# Altium schematic sheet Shield.SchDoc
size B; SheetNumber: 1; SheetTotal: 3
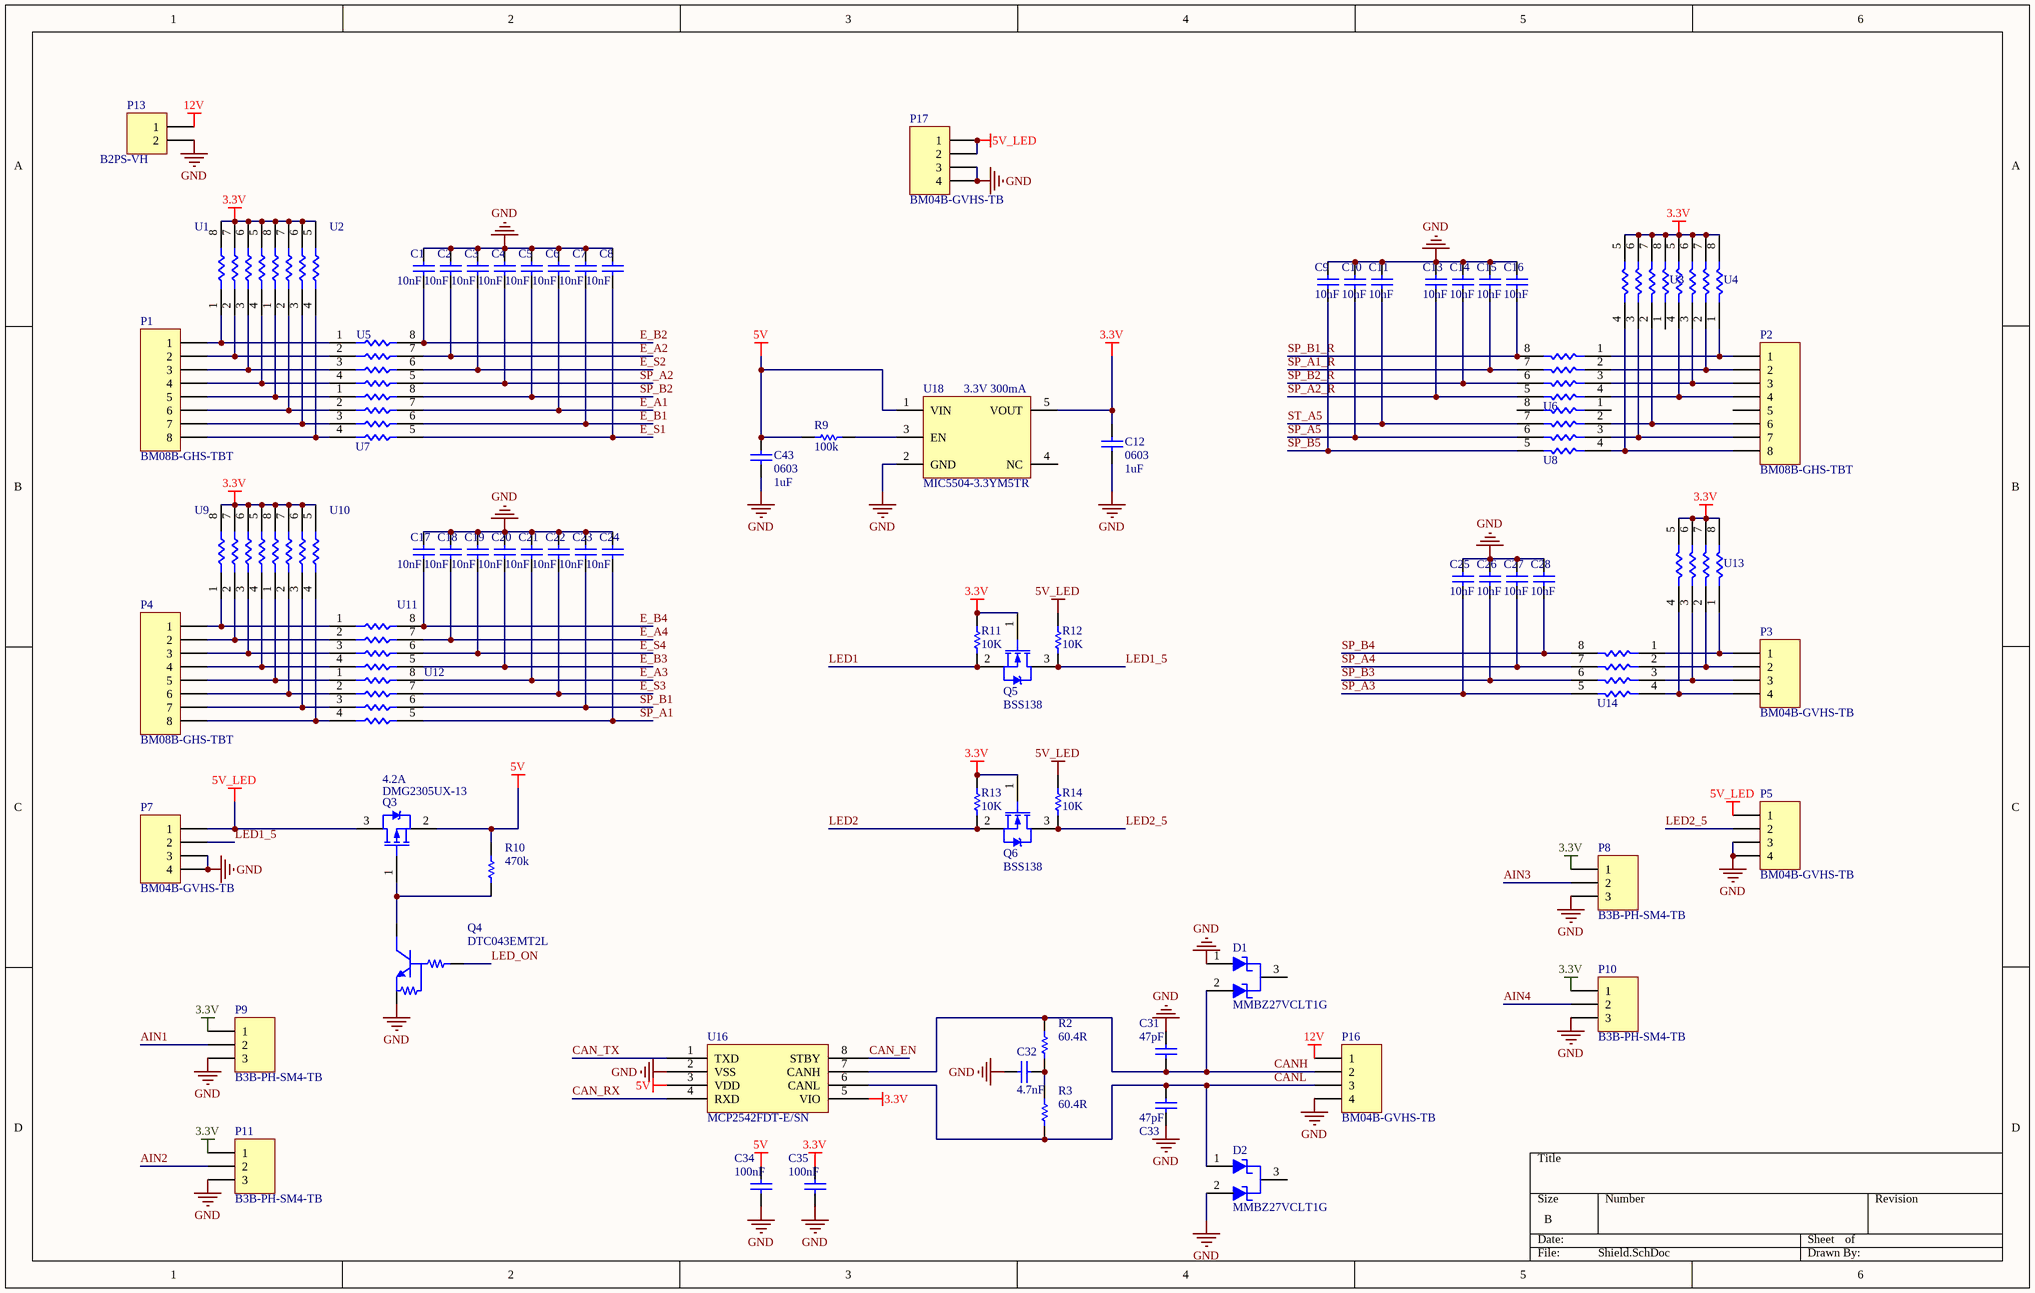
[diagram p0: Shield.SchDoc]

## Parts
C1  10nF  [C0402]
C2  10nF  [C0402]
C3  10nF  [C0402]
C4  10nF  [C0402]
C5  10nF  [C0402]
C6  10nF  [C0402]
C7  10nF  [C0402]
C8  10nF  [C0402]
C9  10nF  [C0402]
C10  10nF  [C0402]
C11  10nF  [C0402]
C12  0603  value 1uF  [C0603]
C13  10nF  [C0402]
C14  10nF  [C0402]
C15  10nF  [C0402]
C16  10nF  [C0402]
C17  10nF  [C0402]
C18  10nF  [C0402]
C19  10nF  [C0402]
C20  10nF  [C0402]
C21  10nF  [C0402]
C22  10nF  [C0402]
C23  10nF  [C0402]
C24  10nF  [C0402]
C25  10nF  [C0402]
C26  10nF  [C0402]
C27  10nF  [C0402]
C28  10nF  [C0402]
C31  47pF  [C0402]
C32  4.7nF  [C0402]
C33  47pF  [C0402]
C34  100nF  [C0402]
C35  100nF  [C0402]
C43  0603  value 1uF  [C0603]
D1  MMBZ27VCLT1G  [SOT-23]
D2  MMBZ27VCLT1G  [SOT-23]
P1  BM08B-GHS-TBT  [CONN-BM08B-GHS-TBT]
P2  BM08B-GHS-TBT  [CONN-BM08B-GHS-TBT - INVERTED]
P3  BM04B-GVHS-TB  [CONN-SM04B-GHSV-TB - INVERTED]
P4  BM08B-GHS-TBT  [CONN-BM08B-GHS-TBT]
P5  BM04B-GVHS-TB  [CONN-SM04B-GHSV-TB - INVERTED]
P7  BM04B-GVHS-TB  [CONN-SM04B-GHSV-TB]
P8  B3B-PH-SM4-TB  [CONN-B3B-PH-SM4-TB]
P9  B3B-PH-SM4-TB  [CONN-B3B-PH-SM4-TB]
P10  B3B-PH-SM4-TB  [CONN-B3B-PH-SM4-TB]
P11  B3B-PH-SM4-TB  [CONN-B3B-PH-SM4-TB]
P13  B2PS-VH  [CONN-B2PS-VH]
P16  BM04B-GVHS-TB  [CONN-SM04B-GHSV-TB - INVERTED]
P17  BM04B-GVHS-TB  [CONN-SM04B-GHSV-TB - INVERTED]
Q3  DMG2305UX-13  Continuous Drain Current (ID): 4.2A  [SOT23-3]
Q4  DTC043EMT2L  [SOT-723]
Q5  BSS138  [SOT-23]
Q6  BSS138  [SOT-23]
R2  60.4R  [R0402]
R3  60.4R  [R0402]
R9  value 100k  [R0402]
R10  value 470k  [R0402]
R11  value 10K  [R0402]  (hidden comment: Res1)
R12  value 10K  [R0402]  (hidden comment: Res1)
R13  value 10K  [R0402]  (hidden comment: Res1)
R14  value 10K  [R0402]  (hidden comment: Res1)
U1  CAY16-1002F4LF  [RES_ARRAY_4]  (value not drawn)
U2  CAY16-1002F4LF  [RES_ARRAY_4]  (value not drawn)
U3  CAY16-1002F4LF  [RES_ARRAY_4 - INVERTED]  (value not drawn)
U4  CAY16-1002F4LF  [RES_ARRAY_4 - INVERTED]  (value not drawn)
U5  CAY16-1002F4LF  [RES_ARRAY_4 - INVERTED]  (value not drawn)
U6  CAY16-1002F4LF  [RES_ARRAY_4]  (value not drawn)
U7  CAY16-1002F4LF  [RES_ARRAY_4 - INVERTED]  (value not drawn)
U8  CAY16-1002F4LF  [RES_ARRAY_4]  (value not drawn)
U9  CAY16-1002F4LF  [RES_ARRAY_4]  (value not drawn)
U10  CAY16-1002F4LF  [RES_ARRAY_4]  (value not drawn)
U11  CAY16-1002F4LF  [RES_ARRAY_4 - INVERTED]  (value not drawn)
U12  CAY16-1002F4LF  [RES_ARRAY_4 - INVERTED]  (value not drawn)
U13  CAY16-1002F4LF  [RES_ARRAY_4]  (value not drawn)
U14  CAY16-1002F4LF  [RES_ARRAY_4]  (value not drawn)
U16  MCP2542FDT-E/SN  [SOIC-8(150MIL)]
U18  MIC5504-3.3YM5TR  value 3.3V 300mA  [SOT23-5]

## Nets
3.3V: C12.2 C35.2 P8.1 P9.1 P10.1 P11.1 Q5.1(G) Q6.1(G) R11.1 R13.1 U1.5 U1.6 U1.7 U1.8 U2.5 U2.6 U2.7 U2.8 U3.5 U3.6 U3.7 U3.8 U4.5 U4.6 U4.7 U4.8 U9.5 U9.6 U9.7 U9.8 U10.5 U10.6 U10.7 U10.8 U13.5 U13.6 U13.7 U13.8 U16.5(VIO) U18.5(VOUT)
5V: C34.2 C43.2 Q3.2(S) R9.1 R10.2 U16.3(VDD) U18.1(VIN)
5V_LED: P5.1 P7.1 P17.1 P17.2 Q3.3(D) R12.1 R14.1
12V: P13.1 P16.1
GND: C1.2 C2.2 C3.2 C4.2 C5.2 C6.2 C7.2 C8.2 C9.2 C10.2 C11.2 C12.1 C13.2 C14.2 C15.2 C16.2 C17.2 C18.2 C19.2 C20.2 C21.2 C22.2 C23.2 C24.2 C25.2 C26.2 C27.2 C28.2 C31.2 C32.2 C33.1 C34.1 C35.1 C43.1 D1.1 D2.2(C) P5.3 P5.4 P7.3 P7.4 P8.3 P9.3 P10.3 P11.3 P13.2 P16.4 P17.3 P17.4 Q4.2(E) U16.2(VSS) U18.2(GND)
AIN1: P9.2
AIN2: P11.2
AIN3: P8.2
AIN4: P10.2
CAN_EN: U16.8(STBY)
CAN_RX: U16.4(RXD)
CAN_TX: U16.1(TXD)
CANH: C31.1 D1.2(C) P16.2 R2.2 U16.7(CANH)
CANL: C33.2 D2.1 P16.3 R3.1 U16.6(CANL)
E_A1: C6.1 U7.7
E_A2: C2.1 U5.7
E_A3: C21.1 U12.8
E_A4: C18.1 U11.7
E_B1: C7.1 U7.6
E_B2: C1.1 U5.8
E_B3: C20.1 U11.5
E_B4: C17.1 U11.8
E_S1: C8.1 U7.5
E_S2: C3.1 U5.6
E_S3: C22.1 U12.7
E_S4: C19.1 U11.6
LED1: Q5.2(S) R11.2
LED1_5: P7.2 Q5.3(D) R12.2
LED2: Q6.2(S) R13.2
LED2_5: P5.2 Q6.3(D) R14.2
LED_ON: Q4.1(B)
SP_A1: C24.1 U12.5
SP_A1_R: C15.1 U6.7
SP_A2: C4.1 U5.5
SP_A2_R: C13.1 U6.5
SP_A3: C25.1 U14.5
SP_A4: C27.1 U14.7
SP_A5: C10.1 U8.6
SP_B1: C23.1 U12.6
SP_B1_R: C16.1 U6.8
SP_B2: C5.1 U7.8
SP_B2_R: C14.1 U6.6
SP_B3: C26.1 U14.6
SP_B4: C28.1 U14.8
SP_B5: C9.1 U8.5
ST_A5: C11.1 U8.7
NetC32_1: C32.1 R2.1 R3.2
NetP1_1: P1.1 U1.1 U5.1
NetP1_2: P1.2 U1.2 U5.2
NetP1_3: P1.3 U1.3 U5.3
NetP1_4: P1.4 U1.4 U5.4
NetP1_5: P1.5 U2.1 U7.1
NetP1_6: P1.6 U2.2 U7.2
NetP1_7: P1.7 U2.3 U7.3
NetP1_8: P1.8 U2.4 U7.4
NetP2_1: P2.1 U4.1 U6.1
NetP2_2: P2.2 U4.2 U6.2
NetP2_3: P2.3 U4.3 U6.3
NetP2_4: P2.4 U4.4 U6.4
NetP2_6: P2.6 U3.2 U8.2
NetP2_7: P2.7 U3.3 U8.3
NetP2_8: P2.8 U3.4 U8.4
NetP3_1: P3.1 U13.1 U14.1
NetP3_2: P3.2 U13.2 U14.2
NetP3_3: P3.3 U13.3 U14.3
NetP3_4: P3.4 U13.4 U14.4
NetP4_1: P4.1 U9.1 U11.1
NetP4_2: P4.2 U9.2 U11.2
NetP4_3: P4.3 U9.3 U11.3
NetP4_4: P4.4 U9.4 U11.4
NetP4_5: P4.5 U10.1 U12.1
NetP4_6: P4.6 U10.2 U12.2
NetP4_7: P4.7 U10.3 U12.3
NetP4_8: P4.8 U10.4 U12.4
NetQ3_1: Q3.1(G) Q4.3(C) R10.1
NetR9_2: R9.2 U18.3(EN)

Not connected (* = marked no-connect by the designer): D1 3(K); D2 3(K); P2 5; U3 1; U8 1 8; U18 4(NC)

## Library data of the parts
C1-C11 C13-C28 = Cap: Multilayer Ceramic Capacitor, 0.01 uF, 16 V, ± 5%, C0G (NP0), 0402 [1005 Metric]; Manufacturer: Yageo; Manufacturer Part Number: CC0402KRX7R7BB103; Voltage Rating: 16V; Tolerance: 10%; Dielectric: X7R; Insulation Resistance: 10GR; Dissipation Factor: 3.5%; Supplier 1: Digi-Key; Supplier Part Number 1: 311-1042-1-ND; RoHS: Yes; Category: Ceramic Capacitors; Stock 1: 2573957; Pricing 1: 1=0.1, 10=0.016, 50=0.0088, 100=0.0071, 500=0.0051, 1000=0.004, 2500=0.00364, 5000=0.00335 (USD); Mount: Surface Mount; Case/Package: 0402; Number of Pins: 2; Case Code (Metric): 1005; Case Code (Imperial): 0402; Min Operating Temperature: -55°C; Max Operating Temperature: 125°C; Capacitance: 10nF; Packaging: Tape and Reel; Series: CC; Voltage Rating (DC): 16V; Termination: SMD/SMT; Package Quantity: 1; Length: 1mm; Width: 0.02inch; Height: 0.5mm; Depth: 0.5mm; Thickness: 0.022inch; Radiation Hardening: No; RoHS Compliant: Yes; Reach SVHC Compliant: No; Lead Free: Lead Free; Halogen Free: Halogen Free; ComponentLink1URL: https://datasheet.ciiva.com/143/mlccorderingcode-143951.pdf?src-supplier=Digi-Key; ComponentLink1Description: https://datasheet.ciiva.com/143/mlccorderingcode-143951.pdf?src-supplier=Digi-Key; ComponentLink2URL: https://datasheet.ciiva.com/143/mlccorderingcode-143950.pdf?src-supplier=Digi-Key; ComponentLink2Description: https://datasheet.ciiva.com/143/mlccorderingcode-143950.pdf?src-supplier=Digi-Key; ComponentLink3URL: https://datasheet.ciiva.com/143/upy-gphc-x7r-6-3v-to-50v-8-143952.pdf?src-supplier=Digi-Key; ComponentLink3Description: https://datasheet.ciiva.com/143/upy-gphc-x7r-6-3v-to-50v-8-143952.pdf?src-supplier=Digi-Key; ComponentLink4URL: https://datasheet.ciiva.com/8033/70765-8033655.pdf?src-supplier=Element14; ComponentLink4Description: https://datasheet.ciiva.com/8033/70765-8033655.pdf?src-supplier=Element14; ComponentLink5URL: https://datasheet.ciiva.com/7978/1489800-7978109.pdf?src-supplier=Element14; ComponentLink5Description: https://datasheet.ciiva.com/7978/1489800-7978109.pdf?src-supplier=Element14; ComponentLink6URL: https://datasheet.ciiva.com/28450/1489800-28450330.pdf?src-supplier=Element14; ComponentLink6Description: https://datasheet.ciiva.com/28450/1489800-28450330.pdf?src-supplier=Element14; ComponentLink7URL: https://datasheet.ciiva.com/8033/1489800-8033659.pdf?src-supplier=Element14; ComponentLink7Description: https://datasheet.ciiva.com/8033/1489800-8033659.pdf?src-supplier=Element14; ComponentLink8URL: https://datasheet.ciiva.com/8033/1489800-8033658.pdf?src-supplier=Element14; ComponentLink8Description: https://datasheet.ciiva.com/8033/1489800-8033658.pdf?src-supplier=Element14; ComponentLink9URL: https://datasheet.ciiva.com/5425/upy-gp-np0-16v-to-50v-8-3714-5425438.pdf?src-supplier=Mouser; ComponentLink9Description: https://datasheet.ciiva.com/5425/upy-gp-np0-16v-to-50v-8-3714-5425438.pdf?src-supplier=Mouser
C12 C43 = Cap: Capacitor; Published: 8-Jun-2000; LatestRevisionDate: 17-Jul-2002; LatestRevisionNote: Re-released for DXP Platform.; PackageReference: RAD-0.3; Publisher: Altium Limited; PackageDescription: Radial Cap, Thru-Hole; 2 Leads; 0.3 in Pin Spacing
C31 C33 = Cap: Cap Cer 47PF 100V C0G/NP0 0402; Manufacturer: Wurth Electronics; Manufacturer Part Number: 885012005078; Tolerance: 5%; Supplier 1: Digi-Key; Supplier Part Number 1: 732-12071-1-ND; RoHS: Yes; Category: Ceramic Capacitors; Stock 1: 57686; Pricing 1: 1=0.1, 10=0.039, 100=0.035, 500=0.031 (USD); Mount: Surface Mount; Case/Package: 0402; Case Code (Imperial): 0402; Case Code (Metric): 1005; Min Operating Temperature: -55°C; Max Operating Temperature: 125°C; Packaging: Cut Tape; Capacitance: 47pF; Series: WCAP-CSGP; Voltage Rating: 100V; ComponentLink1URL: http://www.farnell.com/datasheets/2546566.pdf?src-supplier=Farnell; ComponentLink1Description: http://www.farnell.com/datasheets/2546566.pdf?src-supplier=Farnell; ComponentLink2URL: https://katalog.we-online.de/pbs/datasheet/885012005078.pdf?src-supplier=Digi-Key; ComponentLink2Description: https://katalog.we-online.de/pbs/datasheet/885012005078.pdf?src-supplier=Digi-Key; ComponentLink3URL: http://www.farnell.com/datasheets/2546566.pdf?src-supplier=Newark; ComponentLink3Description: http://www.farnell.com/datasheets/2546566.pdf?src-supplier=Newark
C32 = Cap: Cap Cer 4700PF 100V X7R 0402; Manufacturer: Wurth Electronics; Manufacturer Part Number: 885012205084; Tolerance: 10%; Supplier 1: Digi-Key; Supplier Part Number 1: 732-12234-1-ND; RoHS: No; Category: Ceramic Capacitors; Stock 1: 14393; Pricing 1: 1=0.1, 10=0.039, 100=0.035, 500=0.031 (USD); Mount: Surface Mount; Case/Package: 0402; Case Code (Imperial): 0402; Case Code (Metric): 1005; Min Operating Temperature: -55°C; Max Operating Temperature: 125°C; Packaging: Cut Tape; Capacitance: 4.7nF; Series: WCAP-CSGP; Voltage Rating: 100V; ComponentLink1URL: http://www.farnell.com/datasheets/2546792.pdf?src-supplier=Farnell; ComponentLink1Description: http://www.farnell.com/datasheets/2546792.pdf?src-supplier=Farnell; ComponentLink2URL: https://katalog.we-online.de/pbs/datasheet/885012205084.pdf?src-supplier=Digi-Key; ComponentLink2Description: https://katalog.we-online.de/pbs/datasheet/885012205084.pdf?src-supplier=Digi-Key; ComponentLink3URL: http://www.farnell.com/datasheets/2546792.pdf?src-supplier=Newark; ComponentLink3Description: http://www.farnell.com/datasheets/2546792.pdf?src-supplier=Newark; ComponentLink4URL: http://www.farnell.com/datasheets/2546792.pdf?src-supplier=Element14; ComponentLink4Description: http://www.farnell.com/datasheets/2546792.pdf?src-supplier=Element14
C34 C35 = Cap: 100nF ±10% 16V X7R 0402 Multilayer Ceramic Capacitors MLCC - SMD/SMT RoHS; Manufacturer: KEMET; Manufacturer Part Number: C0402C104K4RAC-TU; Dissipation Factor: 3.5%; Supplier 1: Digi-Key; Supplier Part Number 1: 399-C0402C104K4RAC7867CT-ND; RoHS: Yes; Category: Ceramic Capacitors; Stock 1: 4665619; Pricing 1: 1=0.1, 10=0.032, 50=0.0172, 100=0.0141, 500=0.01008, 1000=0.00792, 2500=0.0072, 5000=0.00662 (USD); Case/Package: 0402; Number of Pins: 2; Case Code (Metric): 1005; Case Code (Imperial): 0402; Dielectric Material: Ceramic; Min Operating Temperature: -55°C; Max Operating Temperature: 125°C; Capacitance: 100nF; Tolerance: 10%; Voltage Rating: 16V; Packaging: Tape and Reel; Series: C; Dielectric: X7R; Voltage: 16V; Termination: SMD/SMT; Length: 1mm; Height: 0.5mm; Depth: 0.5mm; Reach SVHC Compliant: No
D1 D2 = MMBZ27VCLT1G: TVS DIODE 22VWM 38VC SOT23; Manufacturer: ON Semiconductor; Direction: Unidirectional,Bidirectional; Number of Elements: 2; Reverse Breakdown Voltage: 25.65V; Operating Supply Voltage: 22V; Max Surge Current: 1A; Polarity: Unidirectional; Clamping Voltage: 38V; Peak Pulse Power: 40W; Power Line Protection: No; Leakage Current: 50nA; Test Current: 1mA; ESD Protection: Yes; Diode Type: ZENER; Max Breakdown Voltage: 28.35V; Voltage Rating (DC): 27V; Supplier 1: Digi-Key; Supplier Part Number 1: MMBZ27VCLT1GOSCT-ND; Manufacturer Part Number: MMBZ27VCLT1G; RoHS: Yes; Category: Zener Diodes; Stock 1: 25970; Pricing 1: 1=0.2, 10=0.14, 100=0.0684, 500=0.05708, 1000=0.03966 (USD); Case/Package: SOT-23-3; Number of Pins: 3; Min Operating Temperature: -55°C; Max Operating Temperature: 150°C; Package Quantity: 3000; Packaging: Tape and Reel; Number of Channels: 2; Breakdown Voltage: 25.65V; Termination: SMD/SMT; Number of Unidirectional Channels: 2; Reverse Standoff Voltage: 22V; Min Breakdown Voltage: 25.65V; Working Voltage: 22V; Peak Pulse Current: 1A; Max Reverse Leakage Current: 50nA; Series: -; Power Dissipation: 40W; Clamping Voltage-Max: 38V; Length: 2.9mm; Width: 1.3mm; Height: 0.94mm; Depth: 1.3mm; Radiation Hardening: No; Reach SVHC Compliant: No; Lead Free: Lead Free; RoHS Compliant: Yes; ComponentLink1URL: https://datasheet.ciiva.com/34303/2011918-34303829.pdf?src-supplier=Jameco; ComponentLink1Description: https://datasheet.ciiva.com/34303/2011918-34303829.pdf?src-supplier=Jameco; ComponentLink2URL: https://datasheet.ciiva.com/18426/70099539-18426859.pdf?src-supplier=Allied+Electronics; ComponentLink2Description: https://datasheet.ciiva.com/18426/70099539-18426859.pdf?src-supplier=Allied+Electronics
P1 P2 P4 = Header 8: Header, 8-Pin; Manufacturer: JST; Supplier 1: Digi-Key; Supplier Part Number 1: 455-BM08B-GHS-TBTCT-ND; Manufacturer Part Number: BM08B-GHS-TBT; RoHS: No; Stock 1: 108322; Pricing 1: 1=0.59, 10=0.512, 100=0.422, 500=0.367, 1000=0.30277 (USD)
P3 P5 P7 P16 P17 = Header 4: Conn Header SMD 4POS 1.25MM; Manufacturer: JST; Supplier 1: DigiKey; Supplier Part Number 1: 455-BM04B-GVHS-TBCT-ND; Manufacturer Part Number: BM04B-GVHS-TB; Stock 1: 920; Pricing 1: 1=0.5, 10=0.422, 100=0.3284, 500=0.2815, 1000=0.23458 (USD)
P8-P11 = Header 3: Header B3B-PH-SM4-TB, 2.00mm, 3-contacts, top entry, SMT /1000/reel; Manufacturer: JST; Supplier 1: Digi-Key; Supplier Part Number 1: 455-B3B-PH-SM4-TBCT-ND; Manufacturer Part Number: B3B-PH-SM4-TB; RoHS: No; Stock 1: 75711; Pricing 1: 1=0.62, 10=0.541, 100=0.4459, 500=0.38772 (USD); Orientation: Vertical
P13 = Header 2: Header B2PS-VH, 3.96mm, 2-contacts, side entry, THT/1000/box; Manufacturer: JST; Number of Positions: 2; Gender: Male; Pitch: 0.156inch; Supplier 1: Digi-Key; Supplier Part Number 1: 455-B2PS-VH-ND; Manufacturer Part Number: B2PS-VH; RoHS: Yes; Category: Connectors; Stock 1: 60240; Pricing 1: 1=0.25, 10=0.209, 100=0.1612, 500=0.13636, 1000=0.11157, 5000=0.09917, 10000=0.08987 (USD); Mount: Through Hole; Color: Natural; Contact Plating: Tin,Lead; Housing Color: Natural; Contact Material: Brass; Housing Material: Nylon; Fastening Type: Ramp; Packaging: Bulk; Package Quantity: 1000; Number of Rows: 1; Termination: Solder; Orientation: Horizontal; Number of Contacts: 2; Series: VH; Contact Type: Male Pin; Contact Mating Length: 0.303inch; Lead Free: Contains Lead; ComponentLink1URL: https://datasheet.ciiva.com/6905/vhseries-6905894.pdf?src-supplier=Digi-Key; ComponentLink1Description: https://datasheet.ciiva.com/6905/vhseries-6905894.pdf?src-supplier=Digi-Key
Q3 = ZXMP10A13FTA: MOSFET P-CH 20V 4.2A SOT23; Manufacturer: Diodes; Rise Time: 13.7ns; Rds On Max: 52mR; Input Capacitance: 808pF; Max Power Dissipation: 1.4W; Turn-On Delay Time: 10.8ns; Turn-Off Delay Time: 79.3ns; Fall Time: 34.7ns; Threshold Voltage: -900mV; Element Configuration: Single; Gate to Source Voltage (Vgs): 8V; Number of Channels: 1; Drain to Source Breakdown Voltage: -20V; On-State Resistance: 65MR; Supplier 1: Digi-Key; Supplier Part Number 1: DMG2305UX-13DICT-ND; Manufacturer Part Number: DMG2305UX-13; Stock 1: 562398; Pricing 1: 1=0.38, 10=0.348, 100=0.1948, 500=0.1044, 1000=0.071 (EUR); Mount: Surface Mount; Case/Package: SOT-23; Number of Pins: 3; Weight: 0.000282oz; Min Operating Temperature: -55°C; Max Operating Temperature: 150°C; Package Quantity: 1; Packaging: Tape and Reel; Drain to Source Voltage (Vdss): 20V; Drain to Source Resistance: 52mR; Length: 3mm; Height: 1.1mm; Width: 1.4mm; Radiation Hardening: No; REACH SVHC: No SVHC; Lead Free: Lead Free; ComponentLink1URL: http://www.diodes.com/datasheets/DMG2305UX.pdf; ComponentLink1Description: http://www.diodes.com/datasheets/DMG2305UX.pdf; ComponentLink2URL: https://www.diodes.com/assets/Datasheets/DMG2305UX.pdf; ComponentLink2Description: https://www.diodes.com/assets/Datasheets/DMG2305UX.pdf
Q4 = DTC043EMT2L: TRANS PREBIAS NPN 50V VMT3; Manufacturer: Rohm; Max Collector Current: 100mA; Collector Emitter Voltage (VCEO): 150mV; Transition Frequency: 250MHz; Max Power Dissipation: 150mW; Element Configuration: Single; Output Voltage: 50mV; Supplier 1: Digi-Key; Manufacturer Part Number: DTC043EMT2L; Stock 1: 216; Pricing 1: 1=0.2, 10=0.166, 25=0.1392, 100=0.0881, 250=0.068, 500=0.0579, 1000=0.0394, 2500=0.0355 (USD); Mount: Surface Mount; Case/Package: SOT-723; Number of Pins: 3; Max Operating Temperature: 150°C; Packaging: Tape and Reel; Collector Emitter Breakdown Voltage: 50V; Max Breakdown Voltage: 50V; Polarity: NPN; Max Frequency: 250MHz; Continuous Collector Current: 100mA; Package Quantity: 8000; Lead Free: Lead Free; ComponentLink1URL: http://www.mouser.com/ds/2/348/tc043eebtl-e-1019209.pdf?src-supplier=Mouser; ComponentLink1Description: http://www.mouser.com/ds/2/348/tc043eebtl-e-1019209.pdf?src-supplier=Mouser; ComponentLink2URL: http://rohmfs.rohm.com/en/techdata_basic/transistor/taping/VMT3_T2L_taping.pdf?src-supplier=Digi-Key; ComponentLink2Description: http://rohmfs.rohm.com/en/techdata_basic/transistor/taping/VMT3_T2L_taping.pdf?src-supplier=Digi-Key; ComponentLink3URL: http://rohmfs.rohm.com/en/products/databook/datasheet/discrete/transistor/digital/dtc043emt2l-e.pdf?src-supplier=Digi-Key; ComponentLink3Description: http://rohmfs.rohm.com/en/products/databook/datasheet/discrete/transistor/digital/dtc043emt2l-e.pdf?src-supplier=Digi-Key; ComponentLink4URL: http://rohmfs.rohm.com/en/products/databook/datasheet/discrete/transistor/digital/dtc043eb.pdf?src-supplier=Avnet; ComponentLink4Description: http://rohmfs.rohm.com/en/products/databook/datasheet/discrete/transistor/digital/dtc043eb.pdf?src-supplier=Avnet; Supplier Part Number 1: DTC043EMT2LCT-ND
Q5 Q6 = NMOS-2: N-Channel Power MOSFET; Manufacturer 1: Jiangsu Changjing Electronics; Supplier 1: JLCPCB; Supplier Part Number 1: C78284; Manufacturer Part Number 1: BSS138; Value: BSS138
R2 R3 = Res1: Res Thick Film 0402 60.4 Ohm 1% 1/16W ±100ppm/°C Molded SMD SMD Paper T/R; Manufacturer: Vishay; Manufacturer Part Number: CRCW040260R4FKED; Power Rating: 63mW; Voltage Rating: 50V; Supplier 1: Digi-Key; Supplier Part Number 1: 541-60.4LCT-ND; RoHS: Yes; Category: Chip SMD Resistors; Stock 1: 42527; Pricing 1: 1=0.1, 10=0.033, 50=0.0182, 100=0.0134, 500=0.00818, 1000=0.00602, 5000=0.00432 (USD); Case/Package: 0402; Case Code (Imperial): 0402; Case Code (Metric): 1005; Contact Plating: Tin; Size Code: 0402; Weight: 2.3E-05oz; Min Operating Temperature: -55°C; Max Operating Temperature: 155°C; Resistance: 60.4R; Packaging: Tape and Reel; Termination: SMD/SMT; Temperature Coefficient: 100ppm/°C; Series: CRCW; Tolerance: 1%; Number of Terminations: 2; Max Power Dissipation: 63mW; Package Quantity: 10; Voltage Rating (DC): 50V; Features: Automotive AEC-Q200; Resistor Type: Thick Film; Resistance Tolerance: 1%; Construction: Rectangular; Technology: THICK FILM; Length: 1mm; Width: 0.02inch; Height: 0.35mm; Depth: 0.5mm; Ratings: AEC-Q200; Radiation Hardening: No; RoHS Compliant: Yes; Lead Free: Lead Free; Reach SVHC Compliant: Unknown; Military Standard: Not; ComponentLink1URL: https://datasheet.ciiva.com/22705/1697337-22705528.pdf?src-supplier=Element14; ComponentLink1Description: https://datasheet.ciiva.com/22705/1697337-22705528.pdf?src-supplier=Element14; ComponentLink2URL: https://datasheet.ciiva.com/7690/1697337-7690687.pdf?src-supplier=Element14; ComponentLink2Description: https://datasheet.ciiva.com/7690/1697337-7690687.pdf?src-supplier=Element14; ComponentLink3URL: https://datasheet.ciiva.com/22868/70201119-22868795.pdf?src-supplier=Allied+Electronics; ComponentLink3Description: https://datasheet.ciiva.com/22868/70201119-22868795.pdf?src-supplier=Allied+Electronics; ComponentLink4URL: https://datasheet.ciiva.com/16772/70201119-16772855.pdf?src-supplier=Allied+Electronics; ComponentLink4Description: https://datasheet.ciiva.com/16772/70201119-16772855.pdf?src-supplier=Allied+Electronics; ComponentLink5URL: https://datasheet.ciiva.com/2463/dcrcwe3-2463466.pdf?src-supplier=Digi-Key; ComponentLink5Description: https://datasheet.ciiva.com/2463/dcrcwe3-2463466.pdf?src-supplier=Digi-Key; ComponentLink6URL: https://datasheet.ciiva.com/2463/dcrcwe3-2463467.pdf?src-supplier=Digi-Key; ComponentLink6Description: https://datasheet.ciiva.com/2463/dcrcwe3-2463467.pdf?src-supplier=Digi-Key; ComponentLink7URL: https://datasheet.ciiva.com/2463/dcrcwe3-2463468.pdf?src-supplier=Digi-Key; ComponentLink7Description: https://datasheet.ciiva.com/2463/dcrcwe3-2463468.pdf?src-supplier=Digi-Key; ComponentLink8URL: https://datasheet.ciiva.com/16395/dcrcwe3-16395727.pdf?src-supplier=Future+Electronics; ComponentLink8Description: https://datasheet.ciiva.com/16395/dcrcwe3-16395727.pdf?src-supplier=Future+Electronics
R9 R10 = Res1: Res Thick Film 0402 60.4 Ohm 1% 1/16W ±100ppm/°C Molded SMD SMD Paper T/R
R11-R14 = Res1: RES SMD 10 KOHM 1% 1/16W 0402; Manufacturer 1: UNI-ROYAL(Uniroyal Elec); Manufacturer Part Number 1: 0402WGF1002TCE; Footprint: 0402; Supplier 1: JLCPCB; Supplier Part Number 1: C25744
U1-U14 = ResArray4: Res Thick Film Array 10K Ohm 1% 0.25W(1/4W) ±200ppm/C ISOL 8-Pin 1206(4 X 0603) Convex SMD T/R; Manufacturer: Bourns; Resistance: 10kR; Power Rating: 248mW; Voltage Rating: 50V; Number of Elements: 4; Circuit Type: Isolated; Power Per Element: 62.5mW; Temperature Coefficient: 200ppm/°C; Supplier 1: Digi-Key; Supplier Part Number 1: CAY16-1002F4LFCT-ND; Manufacturer Part Number: CAY16-1002F4LF; RoHS: Yes; Category: Resistor Arrays; Stock 1: 99378; Pricing 1: 1=0.1, 10=0.087, 25=0.06, 50=0.0466, 100=0.0333, 250=0.026, 500=0.02066, 1000=0.01467 (USD); Mount: Surface Mount; Case/Package: 1206; Number of Pins: 8; Case Code (Metric): 3216; Case Code (Imperial): 1206; Min Operating Temperature: -55°C; Max Operating Temperature: 125°C; Tolerance: 1%; Packaging: Tape and Reel; Package Quantity: 1; Number of Resistors: 4; Termination: Convex; Voltage Rating (DC): 50V; Number of Circuits: 4; Series: CAY16; Technology: THICK FILM; Resistance Tolerance: 1%; Length: 3.2mm; Width: 0.063inch; Height: 0.024inch; Terminal Pitch: 0.8mm; Depth: 1.6mm; Radiation Hardening: No; Reach SVHC Compliant: No; Military Standard: Not; RoHS Compliant: Yes; ComponentLink1URL: https://datasheet.ciiva.com/36526/1979652-36526231.pdf?src-supplier=Jameco; ComponentLink1Description: https://datasheet.ciiva.com/36526/1979652-36526231.pdf?src-supplier=Jameco; ComponentLink2URL: https://datasheet.ciiva.com/11807/0900766b8064e462-11807542.pdf?src-supplier=Rs; ComponentLink2Description: https://datasheet.ciiva.com/11807/0900766b8064e462-11807542.pdf?src-supplier=Rs; ComponentLink3URL: https://datasheet.ciiva.com/1478/1849489-1478833.pdf?src-supplier=Element14; ComponentLink3Description: https://datasheet.ciiva.com/1478/1849489-1478833.pdf?src-supplier=Element14; ComponentLink4URL: https://datasheet.ciiva.com/1478/1849489-1478834.pdf?src-supplier=Element14; ComponentLink4Description: https://datasheet.ciiva.com/1478/1849489-1478834.pdf?src-supplier=Element14; ComponentLink5URL: https://datasheet.ciiva.com/3264/catcay-3264846.pdf?src-supplier=Avnet; ComponentLink5Description: https://datasheet.ciiva.com/3264/catcay-3264846.pdf?src-supplier=Avnet; ComponentLink6URL: https://datasheet.ciiva.com/15157/getdatasheetpartid-150711-15157709.pdf?src-supplier=Verical; ComponentLink6Description: https://datasheet.ciiva.com/15157/getdatasheetpartid-150711-15157709.pdf?src-supplier=Verical; ComponentLink7URL: https://datasheet.ciiva.com/41449/001055372-da-01-en-wid-arr-cay16-1002f4lf-10k-ohm-4-w-1206-41449959.pdf?src-supplier=Conrad; ComponentLink7Description: https://datasheet.ciiva.com/41449/001055372-da-01-en-wid-arr-cay16-1002f4lf-10k-ohm-4-w-1206-41449959.pdf?src-supplier=Conrad
U16 = MCP2542FDT-E/SN: Can Interface IC Can Fd Transceiver - 8SOIC T/r; Manufacturer: Microchip; Data Rate: 8Mbps; Receiver Hysteresis: 200mV; Supplier 1: Digi-Key; Supplier Part Number 1: MCP2542FDT-E/SNCT-ND; Manufacturer Part Number: MCP2542FDT-E/SN; RoHS: Yes; Category: Interface ICs; Stock 1: 5854; Pricing 1: 1=1.03, 25=0.86, 100=0.79 (USD); Mount: Surface Mount; Case/Package: SOIC; Min Operating Temperature: -40°C; Max Operating Temperature: 125°C; Packaging: Rail/Tube; Series: -; RoHS Compliant: Yes; ComponentLink1URL: http://www.microchip.com/mymicrochip/filehandler.aspx?ddocname=en585412&src-supplier=Digi-Key; ComponentLink1Description: http://www.microchip.com/mymicrochip/filehandler.aspx?ddocname=en585412&src-supplier=Digi-Key; ComponentLink2URL: https://datasheet.octopart.com/MCP2542FDT-E-SN-Microchip-datasheet-98403628.pdf?src-supplier=SHENGYU+ELECTRONICS; ComponentLink2Description: https://datasheet.octopart.com/MCP2542FDT-E-SN-Microchip-datasheet-98403628.pdf?src-supplier=SHENGYU+ELECTRONICS
U18 = MIC5504-3.3YM5TR: IC REG LINEAR 3.3V 300MA SOT23-5; Manufacturer: Microchip Micrel; Min Input Voltage: 2.5V; Max Input Voltage: 5.5V; Dropout Voltage: 380mV; Number of Outputs: 1; Quiescent Current: 38uA; Accuracy: 3%; Operating Supply Current: 42uA; Power Supply Rejection Ratio (PSRR): 60dB; ComponentLink1URL: http://www.diodes.com/_files/datasheets/AP2204.pdf; ComponentLink1Description: http://www.diodes.com/_files/datasheets/AP2204.pdf; Supplier 1: Digi-Key; Manufacturer Part Number: MIC5504-3.3YM5TR; Stock 1: 128319; Pricing 1: 1=0.11, 25=0.0928 (USD); Mount: Surface Mount; Case/Package: SOT-23-5; Number of Pins: 5; Min Operating Temperature: -40°C; Max Operating Temperature: 125°C; Output Current: 300mA; Nominal Output Voltage: 3.3V; Packaging: Tape and Reel; Output Voltage: 3.3V; Max Output Current: 300mA; Length: 2.9mm; Height: 1.1mm; Width: 1.6mm; REACH SVHC: No SVHC; ComponentLink2URL: https://datasheet.ciiva.com/46425/1856860-46425639.pdf; ComponentLink2Description: https://datasheet.ciiva.com/46425/1856860-46425639.pdf; Supplier Part Number 1: 576-4764-1-ND